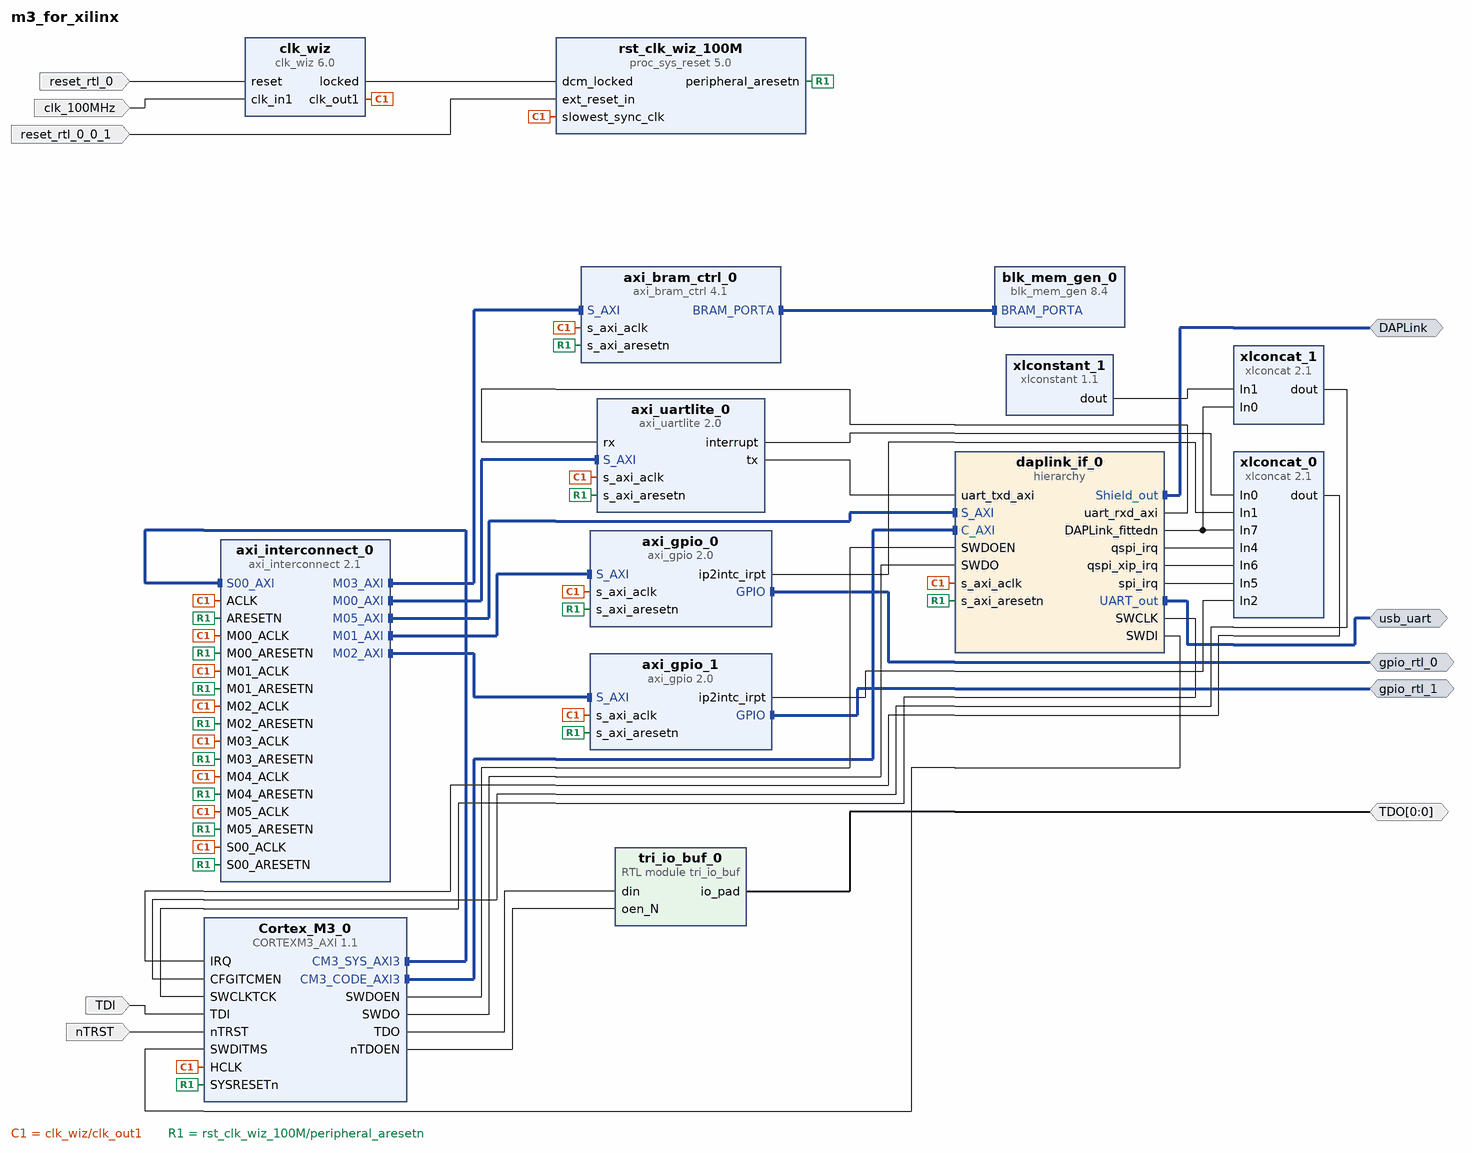
[diagram p0: block diagram of the top level]
# Vivado block design m3_for_xilinx
create_bd_design m3_for_xilinx

create_bd_intf_port -mode Master -vlnv xilinx.com:interface:gpio_rtl:1.0 DAPLink
create_bd_intf_port -mode Master -vlnv xilinx.com:interface:uart_rtl:1.0 usb_uart
create_bd_intf_port -mode Master -vlnv xilinx.com:interface:gpio_rtl:1.0 gpio_rtl_0
create_bd_intf_port -mode Master -vlnv xilinx.com:interface:gpio_rtl:1.0 gpio_rtl_1
create_bd_port -dir IO -from 0 -to 0 TDO
create_bd_port -dir I TDI
create_bd_port -dir I nTRST
create_bd_port -dir I -type rst reset_rtl_0
set_property -dict {CONFIG.POLARITY ACTIVE_HIGH} [get_bd_ports reset_rtl_0]
create_bd_port -dir I -type clk clk_100MHz
set_property -dict {CONFIG.FREQ_HZ 100000000} [get_bd_ports clk_100MHz]
create_bd_port -dir I -type rst reset_rtl_0_0_1
set_property -dict {CONFIG.POLARITY ACTIVE_LOW} [get_bd_ports reset_rtl_0_0_1]

create_bd_cell -type ip -vlnv xilinx.com:ip:axi_bram_ctrl:4.1 axi_bram_ctrl_0
set_property -dict {CONFIG.PROTOCOL AXI4LITE CONFIG.SINGLE_PORT_BRAM 1} [get_bd_cells axi_bram_ctrl_0]
create_bd_cell -type ip -vlnv xilinx.com:ip:axi_interconnect:2.1 axi_interconnect_0
set_property -dict [list \
  CONFIG.ENABLE_ADVANCED_OPTIONS 1 \
  CONFIG.M00_HAS_DATA_FIFO 0 \
  CONFIG.M00_HAS_REGSLICE 0 \
  CONFIG.M00_SECURE 0 \
  CONFIG.M01_HAS_DATA_FIFO 0 \
  CONFIG.M01_HAS_REGSLICE 3 \
  CONFIG.M01_SECURE 0 \
  CONFIG.M02_HAS_REGSLICE 3 \
  CONFIG.M02_SECURE 0 \
  CONFIG.M03_HAS_REGSLICE 3 \
  CONFIG.M04_HAS_REGSLICE 3 \
  CONFIG.M05_HAS_REGSLICE 3 \
  CONFIG.NUM_MI 6 \
  CONFIG.NUM_SI 1 \
  CONFIG.S00_HAS_REGSLICE 3 \
  CONFIG.S01_HAS_DATA_FIFO 1 \
  CONFIG.S01_HAS_REGSLICE 3 \
  CONFIG.SYNCHRONIZATION_STAGES 2 \
] [get_bd_cells axi_interconnect_0]
create_bd_cell -type ip -vlnv xilinx.com:ip:axi_uartlite:2.0 axi_uartlite_0
set_property -dict [list \
  CONFIG.C_BAUDRATE 115200 \
  CONFIG.C_S_AXI_ACLK_FREQ_HZ 100000000 \
  CONFIG.UARTLITE_BOARD_INTERFACE Custom \
  CONFIG.USE_BOARD_FLOW true \
] [get_bd_cells axi_uartlite_0]
create_bd_cell -type ip -vlnv xilinx.com:ip:blk_mem_gen:8.4 blk_mem_gen_0
set_property -dict {CONFIG.EN_SAFETY_CKT false} [get_bd_cells blk_mem_gen_0]
create_bd_cell -type hier daplink_if_0
create_bd_cell -type module -reference tri_io_buf tri_io_buf_0
create_bd_cell -type ip -vlnv xilinx.com:ip:xlconcat:2.1 xlconcat_0
set_property -dict {CONFIG.NUM_PORTS 8} [get_bd_cells xlconcat_0]
create_bd_cell -type ip -vlnv xilinx.com:ip:xlconcat:2.1 xlconcat_1
set_property -dict {CONFIG.IN6_WIDTH 25 CONFIG.NUM_PORTS 2} [get_bd_cells xlconcat_1]
create_bd_cell -type ip -vlnv xilinx.com:ip:xlconstant:1.1 xlconstant_1
set_property -dict {CONFIG.CONST_VAL 1 CONFIG.CONST_WIDTH 1} [get_bd_cells xlconstant_1]
create_bd_cell -type ip -vlnv Arm.com:CortexM:CORTEXM3_AXI:1.1 Cortex_M3_0
set_property -dict [list \
  CONFIG.DEBUG_LVL 2 \
  CONFIG.DTCM_SIZE {"0110"} \
  CONFIG.ITCM_INIT_FILE bram_a7.hex \
  CONFIG.ITCM_SIZE {"0110"} \
  CONFIG.TRACE_LVL 1 \
  CONFIG.WIC_PRESENT false \
] [get_bd_cells Cortex_M3_0]
create_bd_cell -type ip -vlnv xilinx.com:ip:clk_wiz:6.0 clk_wiz
create_bd_cell -type ip -vlnv xilinx.com:ip:proc_sys_reset:5.0 rst_clk_wiz_100M
create_bd_cell -type ip -vlnv xilinx.com:ip:axi_gpio:2.0 axi_gpio_0
set_property -dict {CONFIG.C_INTERRUPT_PRESENT 1 CONFIG.USE_BOARD_FLOW true} [get_bd_cells axi_gpio_0]
create_bd_cell -type ip -vlnv xilinx.com:ip:axi_gpio:2.0 axi_gpio_1
set_property -dict {CONFIG.C_INTERRUPT_PRESENT 1 CONFIG.USE_BOARD_FLOW true} [get_bd_cells axi_gpio_1]

# ---- hierarchy /daplink_if_0 ----
current_bd_instance /daplink_if_0
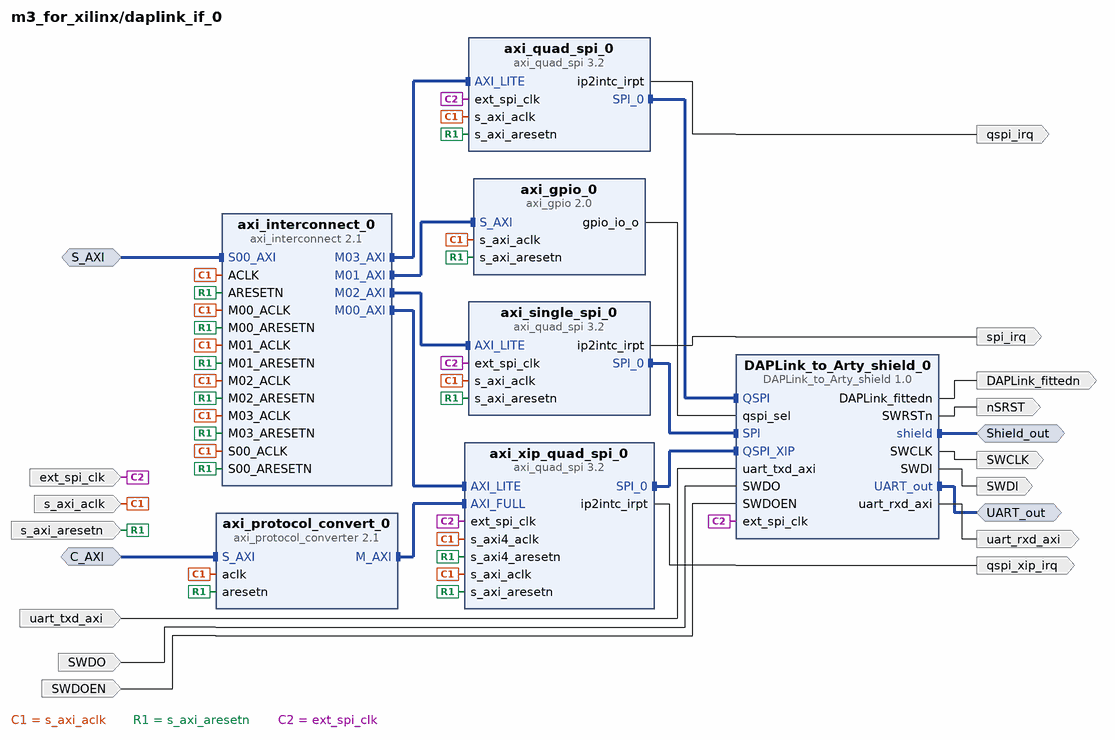
[diagram p1: block diagram inside /daplink_if_0]
create_bd_intf_pin -mode Slave -vlnv xilinx.com:interface:aximm_rtl:1.0 S_AXI
create_bd_intf_pin -mode Master -vlnv xilinx.com:interface:uart_rtl:1.0 UART_out
create_bd_intf_pin -mode Master -vlnv xilinx.com:interface:gpio_rtl:1.0 Shield_out
create_bd_intf_pin -mode Slave -vlnv xilinx.com:interface:aximm_rtl:1.0 C_AXI
create_bd_pin -dir I s_axi_aclk
create_bd_pin -dir I s_axi_aresetn
create_bd_pin -dir O DAPLink_fittedn
create_bd_pin -dir O qspi_irq
create_bd_pin -dir I ext_spi_clk
create_bd_pin -dir O uart_rxd_axi
create_bd_pin -dir O SWDI
create_bd_pin -dir O SWCLK
create_bd_pin -dir O nSRST
create_bd_pin -dir I SWDOEN
create_bd_pin -dir I SWDO
create_bd_pin -dir I uart_txd_axi
create_bd_pin -dir O spi_irq
create_bd_pin -dir O qspi_xip_irq

create_bd_cell -type ip -vlnv xilinx.com:ip:axi_interconnect:2.1 axi_interconnect_0
set_property -dict {CONFIG.NUM_MI 4} [get_bd_cells axi_interconnect_0]
create_bd_cell -type ip -vlnv xilinx.com:ip:axi_quad_spi:3.2 axi_single_spi_0
set_property -dict {CONFIG.C_FIFO_DEPTH 256 CONFIG.C_USE_STARTUP 0} [get_bd_cells axi_single_spi_0]
create_bd_cell -type ip -vlnv xilinx.com:ip:axi_quad_spi:3.2 axi_quad_spi_0
set_property -dict {CONFIG.C_FIFO_DEPTH 256 CONFIG.C_SPI_MODE 2 CONFIG.C_USE_STARTUP 0} [get_bd_cells axi_quad_spi_0]
create_bd_cell -type ip -vlnv xilinx.com:ip:axi_quad_spi:3.2 axi_xip_quad_spi_0
set_property -dict [list \
  CONFIG.C_SPI_MEMORY 3 \
  CONFIG.C_SPI_MEM_ADDR_BITS 24 \
  CONFIG.C_SPI_MODE 2 \
  CONFIG.C_TYPE_OF_AXI4_INTERFACE 1 \
  CONFIG.C_USE_STARTUP 0 \
  CONFIG.C_XIP_MODE 1 \
] [get_bd_cells axi_xip_quad_spi_0]
create_bd_cell -type ip -vlnv xilinx.com:ip:axi_gpio:2.0 axi_gpio_0
create_bd_cell -type ip -vlnv xilinx.com:ip:axi_protocol_converter:2.1 axi_protocol_convert_0
create_bd_cell -type ip -vlnv Arm.com:user:DAPLink_to_Arty_shield:1.0 DAPLink_to_Arty_shield_0

# ---- connections ----

current_bd_instance /daplink_if_0
connect_bd_intf_net -intf_net axi_quad_spi_1_SPI_0 [get_bd_intf_pins axi_quad_spi_0/SPI_0] [get_bd_intf_pins DAPLink_to_Arty_shield_0/QSPI]
connect_bd_intf_net [get_bd_intf_pins DAPLink_to_Arty_shield_0/QSPI_XIP] [get_bd_intf_pins axi_xip_quad_spi_0/SPI_0]
connect_bd_intf_net [get_bd_intf_pins axi_interconnect_0/M00_AXI] [get_bd_intf_pins axi_xip_quad_spi_0/AXI_LITE]
connect_bd_intf_net [get_bd_intf_pins axi_single_spi_0/SPI_0] [get_bd_intf_pins DAPLink_to_Arty_shield_0/SPI]
connect_bd_intf_net [get_bd_intf_pins axi_interconnect_0/M03_AXI] [get_bd_intf_pins axi_quad_spi_0/AXI_LITE]
connect_bd_intf_net [get_bd_intf_pins axi_xip_quad_spi_0/AXI_FULL] [get_bd_intf_pins axi_protocol_convert_0/M_AXI]
connect_bd_intf_net [get_bd_intf_pins C_AXI] [get_bd_intf_pins axi_protocol_convert_0/S_AXI]
connect_bd_intf_net [get_bd_intf_pins axi_interconnect_0/M02_AXI] [get_bd_intf_pins axi_single_spi_0/AXI_LITE]
connect_bd_intf_net [get_bd_intf_pins axi_interconnect_0/M01_AXI] [get_bd_intf_pins axi_gpio_0/S_AXI]
connect_bd_intf_net [get_bd_intf_pins Shield_out] [get_bd_intf_pins DAPLink_to_Arty_shield_0/shield]
connect_bd_intf_net [get_bd_intf_pins UART_out] [get_bd_intf_pins DAPLink_to_Arty_shield_0/UART_out]
connect_bd_intf_net [get_bd_intf_pins S_AXI] [get_bd_intf_pins axi_interconnect_0/S00_AXI]
connect_bd_net [get_bd_pins s_axi_aclk] \
  [get_bd_pins axi_single_spi_0/s_axi_aclk] [get_bd_pins axi_quad_spi_0/s_axi_aclk] \
  [get_bd_pins axi_xip_quad_spi_0/s_axi_aclk] [get_bd_pins axi_gpio_0/s_axi_aclk] \
  [get_bd_pins axi_xip_quad_spi_0/s_axi4_aclk] [get_bd_pins axi_protocol_convert_0/aclk] \
  [get_bd_pins axi_interconnect_0/ACLK] [get_bd_pins axi_interconnect_0/S00_ACLK] [get_bd_pins axi_interconnect_0/M00_ACLK] \
  [get_bd_pins axi_interconnect_0/M01_ACLK] [get_bd_pins axi_interconnect_0/M02_ACLK] \
  [get_bd_pins axi_interconnect_0/M03_ACLK]
connect_bd_net [get_bd_pins s_axi_aresetn] \
  [get_bd_pins axi_single_spi_0/s_axi_aresetn] [get_bd_pins axi_quad_spi_0/s_axi_aresetn] \
  [get_bd_pins axi_xip_quad_spi_0/s_axi_aresetn] [get_bd_pins axi_gpio_0/s_axi_aresetn] \
  [get_bd_pins axi_xip_quad_spi_0/s_axi4_aresetn] [get_bd_pins axi_protocol_convert_0/aresetn] \
  [get_bd_pins axi_interconnect_0/ARESETN] [get_bd_pins axi_interconnect_0/S00_ARESETN] \
  [get_bd_pins axi_interconnect_0/M00_ARESETN] [get_bd_pins axi_interconnect_0/M01_ARESETN] \
  [get_bd_pins axi_interconnect_0/M02_ARESETN] [get_bd_pins axi_interconnect_0/M03_ARESETN]
connect_bd_net -net DAPLink_to_Arty_shie_1_DAPLink_fittedn [get_bd_pins DAPLink_to_Arty_shield_0/DAPLink_fittedn] [get_bd_pins DAPLink_fittedn]
connect_bd_net -net DAPLink_to_Arty_shie_1_uart_rxd_axi [get_bd_pins DAPLink_to_Arty_shield_0/uart_rxd_axi] [get_bd_pins uart_rxd_axi]
connect_bd_net -net DAPLink_to_Arty_shie_1_SWDI [get_bd_pins DAPLink_to_Arty_shield_0/SWDI] [get_bd_pins SWDI]
connect_bd_net -net DAPLink_to_Arty_shie_1_SWCLK [get_bd_pins DAPLink_to_Arty_shield_0/SWCLK] [get_bd_pins SWCLK]
connect_bd_net -net DAPLink_to_Arty_shie_1_SWRSTn [get_bd_pins DAPLink_to_Arty_shield_0/SWRSTn] [get_bd_pins nSRST]
connect_bd_net [get_bd_pins uart_txd_axi] [get_bd_pins DAPLink_to_Arty_shield_0/uart_txd_axi]
connect_bd_net [get_bd_pins ext_spi_clk] \
  [get_bd_pins axi_single_spi_0/ext_spi_clk] [get_bd_pins axi_quad_spi_0/ext_spi_clk] \
  [get_bd_pins axi_xip_quad_spi_0/ext_spi_clk] [get_bd_pins DAPLink_to_Arty_shield_0/ext_spi_clk]
connect_bd_net -net axi_quad_spi_1_ip2intc_irpt [get_bd_pins axi_quad_spi_0/ip2intc_irpt] [get_bd_pins qspi_irq]
connect_bd_net [get_bd_pins axi_single_spi_0/ip2intc_irpt] [get_bd_pins spi_irq]
connect_bd_net [get_bd_pins axi_gpio_0/gpio_io_o] [get_bd_pins DAPLink_to_Arty_shield_0/qspi_sel]
connect_bd_net [get_bd_pins axi_xip_quad_spi_0/ip2intc_irpt] [get_bd_pins qspi_xip_irq]
connect_bd_net [get_bd_pins SWDO] [get_bd_pins DAPLink_to_Arty_shield_0/SWDO]
connect_bd_net [get_bd_pins SWDOEN] [get_bd_pins DAPLink_to_Arty_shield_0/SWDOEN]

current_bd_instance /
connect_bd_intf_net [get_bd_intf_pins axi_bram_ctrl_0/BRAM_PORTA] [get_bd_intf_pins blk_mem_gen_0/BRAM_PORTA]
connect_bd_intf_net -intf_net V2C_DAPLink_interface_UART_out [get_bd_intf_ports usb_uart] [get_bd_intf_pins daplink_if_0/UART_out]
connect_bd_intf_net [get_bd_intf_pins Cortex_M3_0/CM3_SYS_AXI3] [get_bd_intf_pins axi_interconnect_0/S00_AXI]
connect_bd_intf_net [get_bd_intf_pins axi_uartlite_0/S_AXI] [get_bd_intf_pins axi_interconnect_0/M00_AXI]
connect_bd_intf_net [get_bd_intf_pins axi_interconnect_0/M02_AXI] [get_bd_intf_pins axi_gpio_1/S_AXI]
connect_bd_intf_net -intf_net V2C_DAPLink_interface_Shield_out [get_bd_intf_ports DAPLink] [get_bd_intf_pins daplink_if_0/Shield_out]
connect_bd_intf_net [get_bd_intf_pins axi_gpio_0/S_AXI] [get_bd_intf_pins axi_interconnect_0/M01_AXI]
connect_bd_intf_net [get_bd_intf_ports gpio_rtl_1] [get_bd_intf_pins axi_gpio_1/GPIO]
connect_bd_intf_net [get_bd_intf_pins Cortex_M3_0/CM3_CODE_AXI3] [get_bd_intf_pins daplink_if_0/C_AXI]
connect_bd_intf_net [get_bd_intf_pins axi_bram_ctrl_0/S_AXI] [get_bd_intf_pins axi_interconnect_0/M03_AXI]
connect_bd_intf_net [get_bd_intf_ports gpio_rtl_0] [get_bd_intf_pins axi_gpio_0/GPIO]
connect_bd_intf_net [get_bd_intf_pins daplink_if_0/S_AXI] [get_bd_intf_pins axi_interconnect_0/M05_AXI]
connect_bd_net -net TDO_out [get_bd_ports TDO] [get_bd_pins tri_io_buf_0/io_pad]
connect_bd_net -net V2C_DAPLink_interface_DAPLink_fittedn [get_bd_pins daplink_if_0/DAPLink_fittedn] \
  [get_bd_pins xlconcat_1/In0] [get_bd_pins xlconcat_0/In7]
connect_bd_net -net V2C_DAPLink_interface_qspi_irq [get_bd_pins daplink_if_0/qspi_irq] [get_bd_pins xlconcat_0/In4]
connect_bd_net -net V2C_DAPLink_interface_qspi_xip_irq [get_bd_pins daplink_if_0/qspi_xip_irq] [get_bd_pins xlconcat_0/In6]
connect_bd_net -net V2C_DAPLink_interface_spi_irq [get_bd_pins daplink_if_0/spi_irq] [get_bd_pins xlconcat_0/In5]
connect_bd_net -net V2C_DAPLink_interface_uart_rxd_axi [get_bd_pins daplink_if_0/uart_rxd_axi] [get_bd_pins axi_uartlite_0/rx]
connect_bd_net [get_bd_pins axi_uartlite_0/interrupt] [get_bd_pins xlconcat_0/In0]
connect_bd_net [get_bd_pins axi_uartlite_0/tx] [get_bd_pins daplink_if_0/uart_txd_axi]
connect_bd_net -net clk_wiz_0_clk_out1 [get_bd_pins clk_wiz/clk_out1] \
  [get_bd_pins axi_bram_ctrl_0/s_axi_aclk] [get_bd_pins axi_uartlite_0/s_axi_aclk] [get_bd_pins axi_interconnect_0/ACLK] \
  [get_bd_pins axi_interconnect_0/S00_ACLK] [get_bd_pins axi_interconnect_0/M00_ACLK] \
  [get_bd_pins axi_interconnect_0/M01_ACLK] [get_bd_pins axi_interconnect_0/M02_ACLK] \
  [get_bd_pins axi_interconnect_0/M03_ACLK] [get_bd_pins axi_interconnect_0/M04_ACLK] [get_bd_pins daplink_if_0/s_axi_aclk] \
  [get_bd_pins axi_interconnect_0/M05_ACLK] [get_bd_pins Cortex_M3_0/HCLK] [get_bd_pins rst_clk_wiz_100M/slowest_sync_clk] \
  [get_bd_pins axi_gpio_0/s_axi_aclk] [get_bd_pins axi_gpio_1/s_axi_aclk]
connect_bd_net [get_bd_pins xlconstant_1/dout] [get_bd_pins xlconcat_1/In1]
connect_bd_net [get_bd_pins xlconcat_0/dout] [get_bd_pins Cortex_M3_0/IRQ]
connect_bd_net [get_bd_pins xlconcat_1/dout] [get_bd_pins Cortex_M3_0/CFGITCMEN]
connect_bd_net [get_bd_ports TDI] [get_bd_pins Cortex_M3_0/TDI]
connect_bd_net [get_bd_ports nTRST] [get_bd_pins Cortex_M3_0/nTRST]
connect_bd_net -net CortexM3DbgAXI_0_TDO [get_bd_pins Cortex_M3_0/TDO] [get_bd_pins tri_io_buf_0/din]
connect_bd_net -net CortexM3DbgAXI_0_nTDOEN [get_bd_pins Cortex_M3_0/nTDOEN] [get_bd_pins tri_io_buf_0/oen_N]
connect_bd_net -net CortexM3DbgAXI_0_SWDOEN [get_bd_pins Cortex_M3_0/SWDOEN] [get_bd_pins daplink_if_0/SWDOEN]
connect_bd_net -net CortexM3DbgAXI_0_SWDO [get_bd_pins Cortex_M3_0/SWDO] [get_bd_pins daplink_if_0/SWDO]
connect_bd_net [get_bd_pins daplink_if_0/SWCLK] [get_bd_pins Cortex_M3_0/SWCLKTCK]
connect_bd_net [get_bd_pins daplink_if_0/SWDI] [get_bd_pins Cortex_M3_0/SWDITMS]
connect_bd_net [get_bd_pins clk_wiz/locked] [get_bd_pins rst_clk_wiz_100M/dcm_locked]
connect_bd_net [get_bd_pins rst_clk_wiz_100M/peripheral_aresetn] \
  [get_bd_pins axi_bram_ctrl_0/s_axi_aresetn] [get_bd_pins axi_uartlite_0/s_axi_aresetn] \
  [get_bd_pins daplink_if_0/s_axi_aresetn] [get_bd_pins axi_interconnect_0/S00_ARESETN] \
  [get_bd_pins axi_interconnect_0/M00_ARESETN] [get_bd_pins axi_interconnect_0/M01_ARESETN] \
  [get_bd_pins axi_interconnect_0/M02_ARESETN] [get_bd_pins axi_interconnect_0/M03_ARESETN] \
  [get_bd_pins axi_interconnect_0/M04_ARESETN] [get_bd_pins axi_interconnect_0/M05_ARESETN] \
  [get_bd_pins axi_interconnect_0/ARESETN] [get_bd_pins Cortex_M3_0/SYSRESETn] [get_bd_pins axi_gpio_0/s_axi_aresetn] \
  [get_bd_pins axi_gpio_1/s_axi_aresetn]
connect_bd_net -net reset_rtl_0_1 [get_bd_ports reset_rtl_0] [get_bd_pins clk_wiz/reset]
connect_bd_net [get_bd_ports clk_100MHz] [get_bd_pins clk_wiz/clk_in1]
connect_bd_net -net reset_rtl_0_0_1_1 [get_bd_ports reset_rtl_0_0_1] [get_bd_pins rst_clk_wiz_100M/ext_reset_in]
connect_bd_net [get_bd_pins axi_gpio_0/ip2intc_irpt] [get_bd_pins xlconcat_0/In1]
connect_bd_net [get_bd_pins axi_gpio_1/ip2intc_irpt] [get_bd_pins xlconcat_0/In2]

# ---- address map ----
assign_bd_address -offset 0x00000000 -range 1M -target_address_space [get_bd_addr_spaces Cortex_M3_0/CM3_CODE_AXI3] [get_bd_addr_segs daplink_if_0/axi_xip_quad_spi_0/aximm/MEM0]
assign_bd_address -offset 0x40000000 -range 64K -target_address_space [get_bd_addr_spaces Cortex_M3_0/CM3_SYS_AXI3] [get_bd_addr_segs daplink_if_0/axi_xip_quad_spi_0/AXI_LITE/Reg]
assign_bd_address -offset 0x40010000 -range 64K -target_address_space [get_bd_addr_spaces Cortex_M3_0/CM3_SYS_AXI3] [get_bd_addr_segs daplink_if_0/axi_gpio_0/S_AXI/Reg]
assign_bd_address -offset 0x40020000 -range 64K -target_address_space [get_bd_addr_spaces Cortex_M3_0/CM3_SYS_AXI3] [get_bd_addr_segs daplink_if_0/axi_quad_spi_0/AXI_LITE/Reg]
assign_bd_address -offset 0x40030000 -range 64K -target_address_space [get_bd_addr_spaces Cortex_M3_0/CM3_SYS_AXI3] [get_bd_addr_segs daplink_if_0/axi_single_spi_0/AXI_LITE/Reg]
assign_bd_address -offset 0x40100000 -range 64K -target_address_space [get_bd_addr_spaces Cortex_M3_0/CM3_SYS_AXI3] [get_bd_addr_segs axi_uartlite_0/S_AXI/Reg]
assign_bd_address -offset 0x40110000 -range 64K -target_address_space [get_bd_addr_spaces Cortex_M3_0/CM3_SYS_AXI3] [get_bd_addr_segs axi_gpio_0/S_AXI/Reg]
assign_bd_address -offset 0x40120000 -range 64K -target_address_space [get_bd_addr_spaces Cortex_M3_0/CM3_SYS_AXI3] [get_bd_addr_segs axi_gpio_1/S_AXI/Reg]
assign_bd_address -offset 0x60000000 -range 8K -target_address_space [get_bd_addr_spaces Cortex_M3_0/CM3_SYS_AXI3] [get_bd_addr_segs axi_bram_ctrl_0/S_AXI/Mem0]

validate_bd_design
save_bd_design
